# Altium schematic sheet [8] GPS.SchDoc
size A; DocumentNumber: 10; SheetNumber: 10; SheetTotal: 10
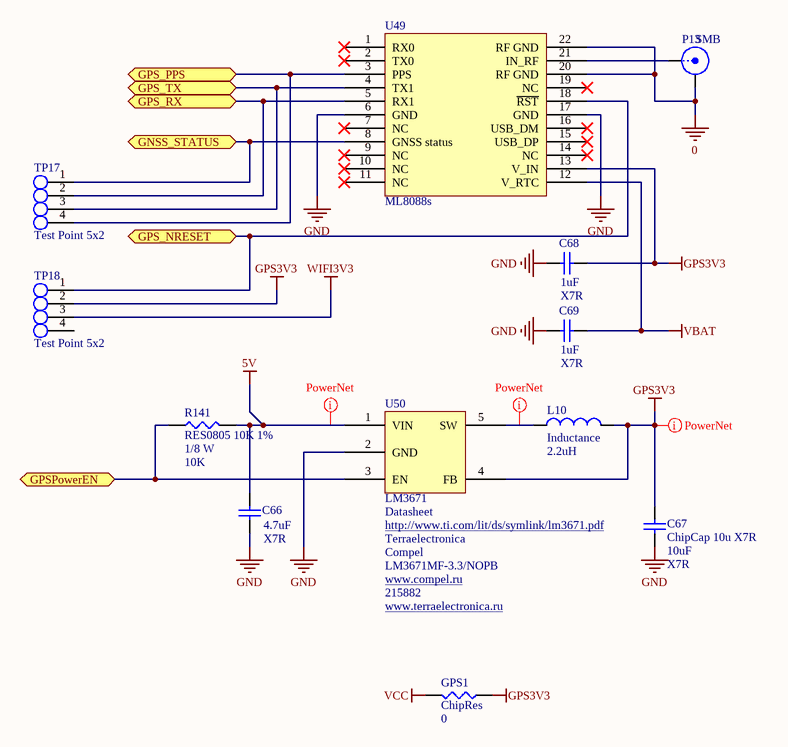
[diagram p0: [8] GPS.SchDoc]

## Parts
C66  value 4.7uF  Type: X7R  [CAP1210]  (hidden comment: ChipCap 4.7u X7R)
C67  ChipCap 10u X7R  value 10uF  Type: X7R  [CAP1210]
C68  value 1uF  Type: X7R  [CAP0805]  (hidden comment: CAP0805 1uF X7R)
C69  value 1uF  Type: X7R  [CAP0805]  (hidden comment: CAP0805 1uF X7R)
GPS1  ChipRes  value 0  [RES0805]
L10  Inductance  value 2.2uH  [CDRH2D14]
P13  SMB  [SMB_V-RJ45]
R141  RES0805 10K 1%  value 10K  Rating: 1/8 W  [RES0805]
TP17  Test Point 5x2  [PG-1.5-13.5-4P-2.54PH]
TP18  Test Point 5x2  [PG-1.5-13.5-4P-2.54PH]
U49  ML8088s  [ML8088s]
U50  LM3671  ComponentLink1Description: Datasheet  Supplier 1: Terraelectronica  Supplier 2: Compel  Supplier Part Number 2: LM3671MF-3.3/NOPB  Supplier Part Number 1: 215882  [SOT23-5]

## Ports
GNSS_STATUS, GPS_NRESET, GPS_PPS, GPS_RX, GPS_TX, GPSPowerEN

## Nets
0: P13.2(Y) U49.20(RF_GND) U49.22(RF_GND)
5V: C66.2 R141.2 U50.1(VIN)
GND: C66.1 C67.1 C68.1 C69.1 U49.6(GND) U49.17(GND) U50.2(GND)
GPS3V3: C67.2 C68.2 GPS1.1 L10.1 TP18.2 U49.13(V_IN) U50.4(FB)
VBAT: C69.2 U49.12(V_RTC)
VCC: GPS1.2
WIFI3V3: TP18.3
GNSS_STATUS: TP17.1 U49.8(GNSS_status) ; port GNSS_STATUS
GPS_NRESET: TP18.1 U49.18(~{RST}) ; port GPS_NRESET
GPS_PPS: TP17.4 U49.3(PPS) ; port GPS_PPS
GPS_RX: TP17.2 U49.5(RX1) ; port GPS_RX
GPS_TX: TP17.3 U49.4(TX1) ; port GPS_TX
GPSPowerEN: R141.1 U50.3(EN) ; port GPSPowerEN
NetL10_2: L10.2 U50.5(SW)
NetP13_1: P13.1(X) U49.21(IN_RF)

Not connected (* = marked no-connect by the designer): TP18 4; U49 1(RX0)* 2(TX0)* 7(NC)* 9(NC)* 10(NC)* 11(NC)* 14(NC)* 15(USB_DP)* 16(USB_DM)* 19(NC)*

## Layout directives
net class Undefined: 5V, GPS3V3, NetL10_2

## Library data of the parts
C66 = ChipCap 4.7uF X7R: Surface-mount ceramic multilayer capacitor; Manufacturer: YAGEO; Voltage: 25V; Tolerance: 10%; ComponentLink1Description: Datasheet; ComponentLink1URL: http://www.deaha.com/pdf/YAGEO-CC_series.pdf
C67 = ChipCap 10uF X7R: Surface-mount ceramic multilayer capacitor; Manufacturer: YAGEO; Voltage: 25V; Tolerance: 10%; ComponentLink1Description: Datasheet; ComponentLink1URL: http://www.deaha.com/pdf/YAGEO-CC_series.pdf
C68 C69 = CAP0805 1uF X7R: Surface-mount ceramic multilayer capacitor; Manufacturer: YAGEO; Manufacturer Part Number: CC0805KKX7R7BB105; Voltage: 16V; Tolerance: 5%; ComponentLink1Description: Datasheet; ComponentLink1URL: http://www.deaha.com/pdf/YAGEO-CC_series.pdf
GPS1 = ChipRes: Chip resistor
L10 = ChipInductance
P13 = SMB: SMB Straight Connector; LatestRevisionDate: 17-Jul-2002; LatestRevisionNote: Re-released for DXP Platform.; Publisher: Altium Limited
R141 = RES0805 10K 1%: Think Film Chip resistor; Manufacturer Part Number: RC0805FR-0710KL; Temperature Coefficient: 100ppm/K; Tolerance: 1%; Type: ThickFilm
TP17 TP18 = PG-1.5-13.5-4P-2.54PH
U49 = ML8088: GPS Receiver
U50 = LM3671MF: 600-mA Step-Down DC-DC Converter; ComponentLink1URL: http://www.ti.com/lit/ds/symlink/lm3671.pdf; Supplier URL 2: www.compel.ru; Supplier URL 1: www.terraelectronica.ru